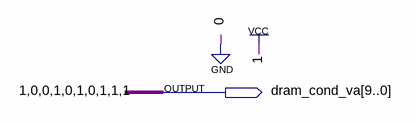
[diagram p0: schematic sheet]
// Quartus schematic dram_cond_va.bdf as structural Verilog: 0 symbols, 1 pins
module dram_cond_va (
  output [9:0] dram_cond_va
);


  assign dram_cond_va = 10'b1001010111;
endmodule
